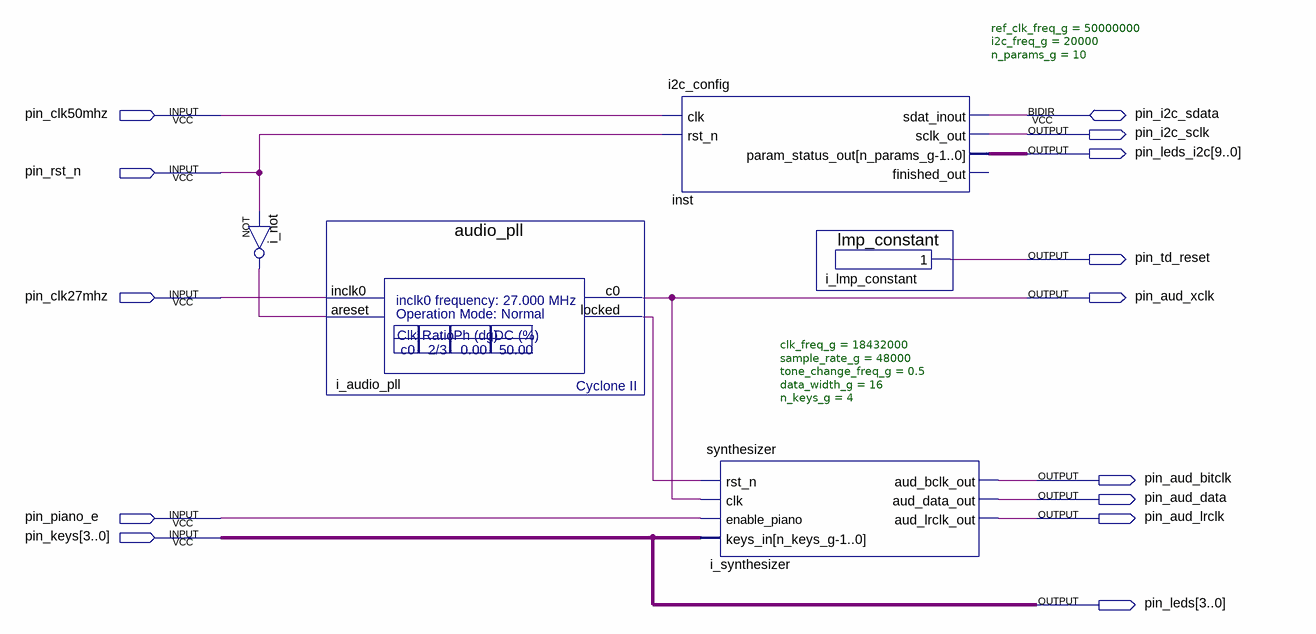
[diagram p0: schematic sheet]
// Quartus schematic system_top_level.bdf as structural Verilog: 5 symbols, 14 pins
module system_top_level (
  input  pin_clk50mhz,
  input  pin_rst_n,
  input  pin_clk27mhz,
  input  pin_piano_e,
  input  [3:0] pin_keys,
  inout  pin_i2c_sdata,
  output pin_i2c_sclk,
  output [9:0] pin_leds_i2c,
  output pin_td_reset,
  output pin_aud_xclk,
  output pin_aud_bitclk,
  output pin_aud_data,
  output pin_aud_lrclk,
  output [3:0] pin_leds
);

  wire i_audio_pll_locked, i_not_out;

  not i_not (i_not_out, pin_rst_n);
  audio_pll i_audio_pll (.inclk0(pin_clk27mhz), .areset(i_not_out), .c0(pin_aud_xclk), .locked(i_audio_pll_locked));
  i2c_config #(.ref_clk_freq_g(50000000), .i2c_freq_g(20000), .n_params_g(10)) inst (
    .clk(pin_clk50mhz), .rst_n(pin_rst_n), .sclk_out(pin_i2c_sclk), .param_status_out(pin_leds_i2c),
    .sdat_inout(pin_i2c_sdata));  // open: finished_out
  synthesizer #(.clk_freq_g(18432000), .sample_rate_g(48000), .tone_change_freq_g(0.5), .data_width_g(16), .n_keys_g(4)) i_synthesizer (
    .rst_n(i_audio_pll_locked), .clk(pin_aud_xclk), .enable_piano(pin_piano_e), .keys_in(pin_keys),
    .aud_bclk_out(pin_aud_bitclk), .aud_data_out(pin_aud_data), .aud_lrclk_out(pin_aud_lrclk));
  lmp_constant i_lmp_constant (.result(pin_td_reset));

  assign pin_leds = pin_keys;
endmodule
